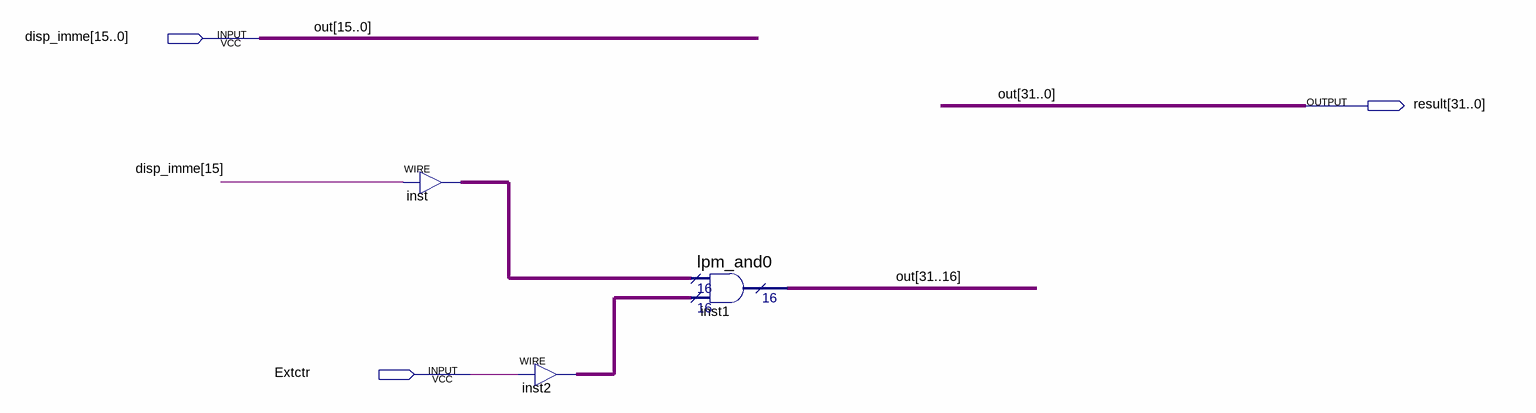
[diagram p0: schematic sheet]
// Quartus schematic ExtU.bdf as structural Verilog: 3 symbols, 3 pins
module ExtU (
  input  [15:0] disp_imme,
  input  Extctr,
  output [31:0] result
);

  wire [15:0] inst2_out, inst_out;

  assign inst_out = {16{disp_imme[15]}};  // WIRE inst
  assign inst2_out = {16{Extctr}};  // WIRE inst2
  lpm_and0 inst1 (.data0x(inst_out), .data1x(inst2_out), .result(result[31:16]));

  assign result[15:0] = disp_imme;

  // Other names for the same wires on the sheet: out[31:0] = {result[31:16], disp_imme}
endmodule
